# Altium project Prototyp2_Exjobb.PrjPcb
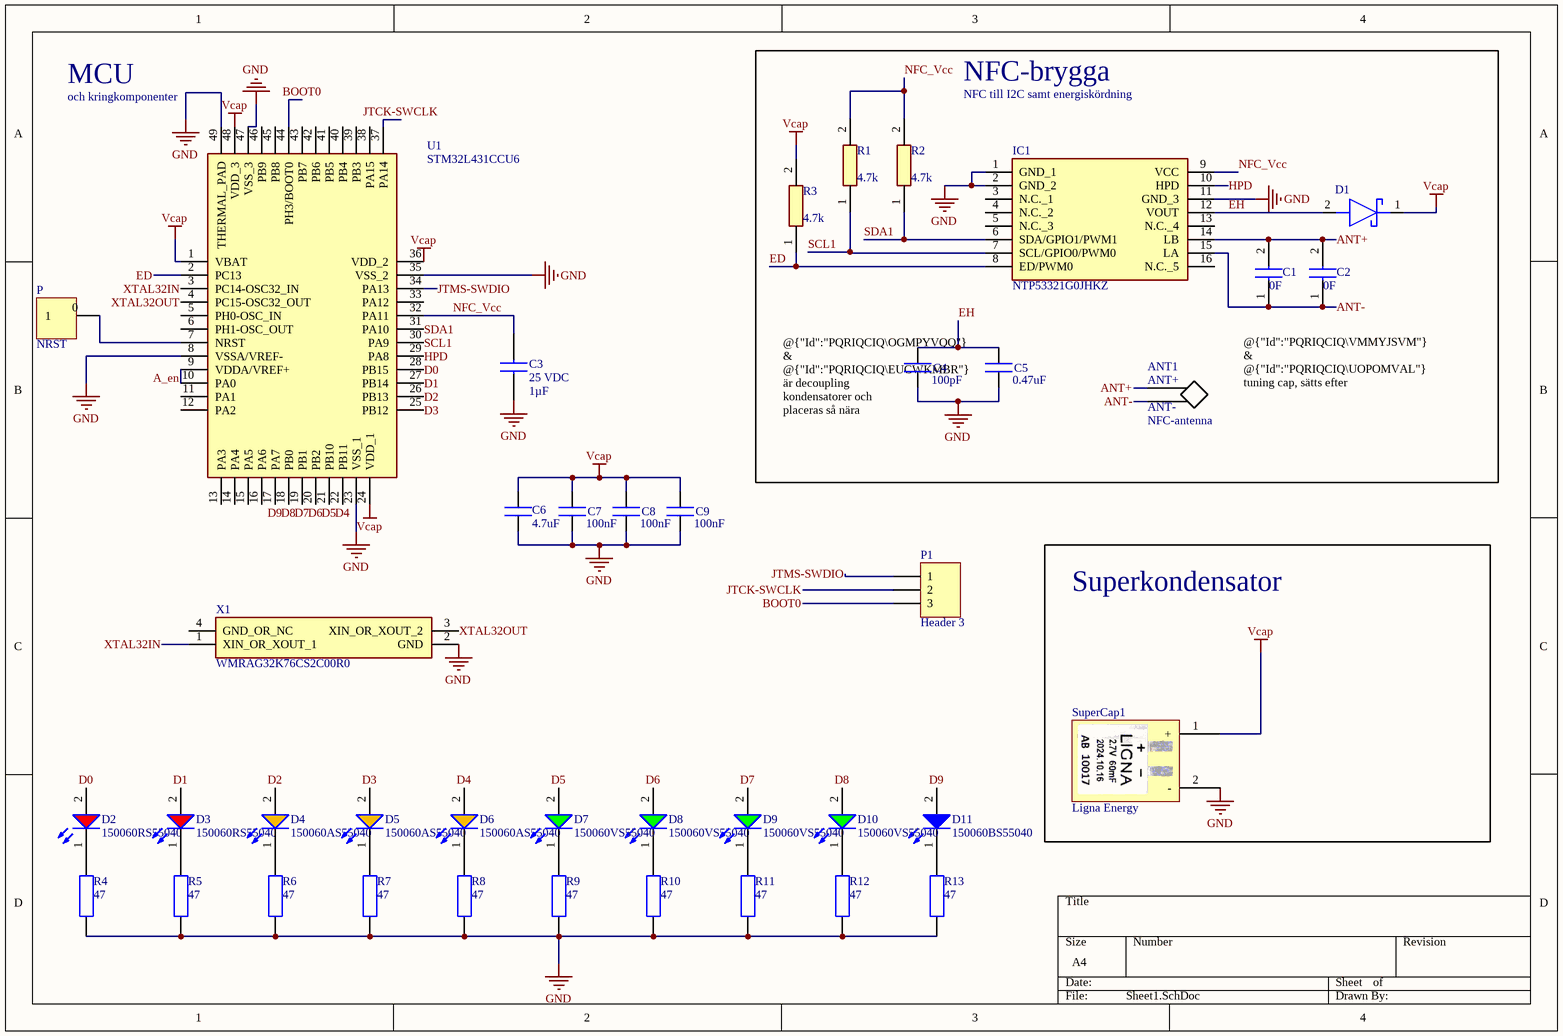
[diagram p0: Sheet1.SchDoc]
1 sheet, 40 parts. Net scope: global (net labels, ports and power ports of the same name join across sheets).
Board files: PCB1.PcbDoc, PCB2.PcbDoc, PCB3.PcbDoc

## Sheet Sheet1.SchDoc
size A4; SheetNumber: 1; SheetTotal: 1

### Parts
ANT1  NFC-antenna  [antenna3]
C1  value 0F  [CAPC1005X70N]  (hidden comment: GRM155C81C474KE01D)
C2  value 0F  [CAPC1005X70N]  (hidden comment: GRM155C81C474KE01D)
C3  value 1µF  Rated Voltage: 25 VDC  [CAPC1005X55N]  (hidden comment: GRM155R61E105KA12D)
C4  capacitance: 100pF  [CAPC1005X70N]  (hidden comment: C0402C101KCGACAUTO)
C5  capacitance: 0.47uF  [CAPC1005X70N]  (hidden comment: C0402C101KCMBASJ105SB7474KFNA01GACAUTO)
C6  capacitance: 4.7uF  [CAPC1005X70N]  (hidden comment: C0402C475K8PACTU)
C7  capacitance: 100nF  [CAPC1005X70N]  (hidden comment: MLAST105SB5104KFNA01)
C8  capacitance: 100nF  [CAPC1005X70N]  (hidden comment: MLAST105SB5104KFNA01)
C9  capacitance: 100nF  [CAPC1005X70N]  (hidden comment: MLAST105SB5104KFNA01)
D1  RBE01VYM6AFHTR  [RBE01VYM6AFHTR]  (value not drawn)
D2  150060RS55040  [WL-SMCD_0603]
D3  150060RS55040  [WL-SMCD_0603]
D4  150060AS55040  [WL-SMCD_0603]
D5  150060AS55040  [WL-SMCD_0603]
D6  150060AS55040  [WL-SMCD_0603]
D7  150060VS55040  [WL-SMCD_0603]
D8  150060VS55040  [WL-SMCD_0603]
D9  150060VS55040  [WL-SMCD_0603]
D10  150060VS55040  [WL-SMCD_0603]
D11  150060BS55040  [WL-SMCD_0603]
IC1  NTP53321G0JHKZ  [NTP53321G0JHKZ]
P  NRST  [Testupoint]
P1  Header 3  [HDR1X3]
R1  Resistance: 4.7k  [RESC1005X40N]  (hidden comment: CRCW04024K70FKEDHP)
R2  Resistance: 4.7k  [RESC1005X40N]  (hidden comment: CRCW04024K70FKEDHP)
R3  Resistance: 4.7k  [RESC1005X40N]  (hidden comment: CRCW04024K70FKEDHP)
R4  resistance: 47  [RESC1005X40N]  (hidden comment: SFR01MZPJ470)
R5  resistance: 47  [RESC1005X40N]  (hidden comment: SFR01MZPJ470)
R6  resistance: 47  [RESC1005X40N]  (hidden comment: SFR01MZPJ470)
R7  resistance: 47  [RESC1005X40N]  (hidden comment: SFR01MZPJ470)
R8  resistance: 47  [RESC1005X40N]  (hidden comment: SFR01MZPJ470)
R9  resistance: 47  [RESC1005X40N]  (hidden comment: SFR01MZPJ470)
R10  resistance: 47  [RESC1005X40N]  (hidden comment: SFR01MZPJ470)
R11  resistance: 47  [RESC1005X40N]  (hidden comment: SFR01MZPJ470)
R12  resistance: 47  [RESC1005X40N]  (hidden comment: SFR01MZPJ470)
R13  resistance: 47  [RESC1005X40N]  (hidden comment: SFR01MZPJ470)
SuperCap1  Ligna Energy  [S-Power 2R slim]
U1  STM32L431CCU6  [QFN50P700X700X60-49N-D]
X1  WMRAG32K76CS2C00R0  [WMRAG32K76CS2C00R0]

### Blocks framed on the sheet
NFC-brygga: ANT1 C1 C2 C4 C5 D1 IC1 R1-R3
Superkondensator: SuperCap1

### Nets
GND: C3.2 C4.1 C5.1 C6.2 C7.2 C8.2 C9.2 IC1.1(GND_1) IC1.2(GND_2) IC1.11(GND_3) R4.1 R5.1 R6.2 R7.2 R8.2 R9.2 R10.2 R11.2 R12.2 R13.2 SuperCap1.2(-) U1.8(VSSA/VREF-) U1.23(VSS_1) U1.35(VSS_2) U1.47(VSS_3) U1.49(THERMAL_PAD) X1.2(GND)
Vcap: C6.1 C7.1 C8.1 C9.1 D1.1(K) R3.2 SuperCap1.1(+) U1.1(VBAT) U1.24(VDD_1) U1.36(VDD_2) U1.48(VDD_3)
A_en: U1.9(VDDA/VREF+) U1.10(PA0)
ANT+: ANT1.1(+) C1.2 C2.2 IC1.14(LB)
ANT-: ANT1.1(-) C1.1 C2.1 IC1.15(LA)
BOOT0: P1.3 U1.44(PH3/BOOT0)
D0: D2.2(A) U1.28(PB15)
D1: D3.2(A) U1.27(PB14)
D2: D4.2(A) U1.26(PB13)
D3: D5.2(A) U1.25(PB12)
D4: D6.2(A) U1.22(PB11)
D5: D7.2(A) U1.21(PB10)
D6: D8.2(A) U1.20(PB2)
D7: D9.2(A) U1.19(PB1)
D8: D10.2(A) U1.18(PB0)
D9: D11.2(A) U1.17(PA7)
ED: IC1.8(ED/PWM0) R3.1 U1.2(PC13)
EH: C4.2 C5.2 D1.2(A) IC1.12(VOUT)
HPD: IC1.10(HPD) U1.29(PA8)
JTCK-SWCLK: P1.2 U1.37(PA14)
JTMS-SWDIO: P1.1 U1.34(PA13)
NFC_Vcc: C3.1 IC1.9(VCC) R1.2 R2.2 U1.32(PA11)
SCL1: IC1.7(SCL/GPIO0/PWM0) R1.1 U1.30(PA9)
SDA1: IC1.6(SDA/GPIO1/PWM1) R2.1 U1.31(PA10)
XTAL32IN: U1.3(PC14-OSC32_IN) X1.1(XIN_OR_XOUT_1)
XTAL32OUT: U1.4(PC15-OSC32_OUT) X1.3(XIN_OR_XOUT_2)
NetD2_1: D2.1(K) R4.2
NetD3_1: D3.1(K) R5.2
NetD4_1: D4.1(K) R6.1
NetD5_1: D5.1(K) R7.1
NetD6_1: D6.1(K) R8.1
NetD7_1: D7.1(K) R9.1
NetD8_1: D8.1(K) R10.1
NetD9_1: D9.1(K) R11.1
NetD10_1: D10.1(K) R12.1
NetD11_1: D11.1(K) R13.1
NetP_0: P.0(1) U1.7(NRST)

Not connected (* = marked no-connect by the designer): IC1 3(N.C._1) 4(N.C._2) 5(N.C._3) 13(N.C._4) 16(N.C._5); U1 5(PH0-OSC_IN) 6(PH1-OSC_OUT) 11(PA1) 12(PA2) 13(PA3) 14(PA4) 15(PA5) 16(PA6) 33(PA12) 38(PA15) 39(PB3) 40(PB4) 41(PB5) 42(PB6) 43(PB7) 45(PB8) 46(PB9); X1 4(GND_OR_NC)

### Notes on the sheet
- MCU
- (near U1) och kringkomponenter
- NFC till I2C samt energiskördning
- (near C4) @{"Id":"PQRIQCIQ\OGMPYVQQ"} & @{"Id":"PQRIQCIQ\EUCWKMBR"}
  är decoupling kondensatorer och placeras så nära NTPn som möjligt
- @{"Id":"PQRIQCIQ\VMMYJSVM"} & @{"Id":"PQRIQCIQ\UOPOMVAL"}
  tuning cap, sätts efter uppmätt induktans på antennen
- (in symbol NFC-antenna) ANT+; ANT-

### Library data of the parts
C1 C2 = CMP-001-00140-1: Multilayer Ceramic Capacitors MLCC - SMD/SMT; Manufacturer_Name: Murata Electronics; Design Item ID: GRM155C81C474KE01D; Mouser Part Number: 81-GRM155C81C474KE1D; Height: 0.7mm; Source: SamacSys.SchLib; Mouser Price/Stock: https://www.mouser.com/Search/Refine.aspx?Keyword=81-GRM155C81C474KE1D; Manufacturer_Part_Number: GRM155C81C474KE01D; Datasheet Link: https://search.murata.co.jp/Ceramy/image/img/A01X/G101/ENG/GRM155C81C474KE01-01A.pdf
C3 = CMP-001-00126-1: Capacitor; Manufacturer_Name: Murata Electronics; Datasheet Link: https://search.murata.co.jp/Ceramy/image/img/A01X/G101/ENG/GRM155R61E105KA12-01A.pdf; Source: SamacSys.SchLib; Mouser Part Number: 81-GRM155R61E105KA2D; Arrow Part Number: GRM155R61E105KA12D; Manufacturer_Part_Number: GRM155R61E105KA12D; Design Item ID: GRM155R61E105KA12D; Arrow Price/Stock: https://www.arrow.com/en/products/grm155r61e105ka12d/murata-manufacturing?region=nac; Height: 0.55mm; Mouser Price/Stock: https://www.mouser.co.uk/ProductDetail/Murata-Electronics/GRM155R61E105KA12D?qs=hiffU4J9V6bE4a81t2Mv5A%3D%3D
C4 C5 = Generic capacitor: Multilayer Ceramic Capacitors MLCC - SMD/SMT 500V 0.0001uF C0G 0402 10% AEC-Q200; ComponentLink1Description: New link
  C4: ComponentLink1URL: https://www.mouser.se/ProductDetail/KEMET/C0402C101KCGACAUTO?qs=1Kr7Jg1SGW8kQysZZQPmCw%3D%3D
  C5: ComponentLink1URL: https://www.mouser.se/ProductDetail/TAIYO-YUDEN/MBASJ105SB7474KFNA01?qs=tlsG%2FOw5FFh70%252Bw5vm%252Bxgg%3D%3D
C6 = Generic capacitor: Multilayer Ceramic Capacitors MLCC - SMD/SMT; ComponentLink1Description: New link; ComponentLink1URL: https://www.mouser.se/ProductDetail/TAIYO-YUDEN/MLASJ105BB5475MFNA01?qs=sGAEpiMZZMsh%252B1woXyUXj3XUfju0vRpjpyIV14TsoXE%3D
C7-C9 = Generic capacitor: Multilayer Ceramic Capacitors MLCC - SMD/SMT 25V 0.1uF X5R 0402 10% Medical; ComponentLink1Description: New link; ComponentLink1URL: https://www.mouser.se/ProductDetail/TAIYO-YUDEN/MLAST105SB5104KFNA01?qs=sGAEpiMZZMsh%252B1woXyUXj3XUfju0vRpjIEu19pL458I%3D
D1 = CMP-004-00062-1: DIODE SCHOTTKY 6V 100MA TUMD2M; Manufacturer_Name: ROHM Semiconductor; Mouser Part Number: 755-RBE01VYM6AFHTR; Datasheet Link: https://www.digikey.ph/en/products/detail/rohm-semiconductor/RBE01VYM6AFHTR/24634517; Manufacturer_Part_Number: RBE01VYM6AFHTR; Source: SamacSys.SchLib; Design Item ID: RBE01VYM6AFHTR; Mouser Price/Stock: https://www.mouser.co.uk/ProductDetail/ROHM-Semiconductor/RBE01VYM6AFHTR?qs=VVKQmw408U8czvswzPLZtQ%3D%3D; Height: 0.8mm
D2 D3 = CMP-207942-000007-3: LED RED DIFFUSED 0603 SMD; NexarPartId: 90235565; Reverse Voltage: 5V; Power Dissipation: 48mW; Luminous Intensity: 90mcd; Forward Voltage: 2V; Wavelength: 624nm; Max Junction Temperature (Tj): 115°C; Peak Wavelength: 632nm; Forward Current: 40mA; Viewing Angle: 140°; Case/Package: 0603; Height: 400µm; Packaging: Tape and Reel; Max Operating Temperature: 85°C; Min Operating Temperature: -40°C; Color: Red; Width: 800µm; Dominant Wavelength: 624nm; Length: 1.6mm; Max Reverse Voltage (DC): 5V; RoHS: Compliant
D4-D6 = CMP-03913-134708025-1: 150060AS55040 WL-SMCD SMT Mono-color Chip LED Diffused; Peak Wavelength: 609nm; Forward Current: 40mA; Luminous Intensity: 110mcd; Max Reverse Voltage (DC): 5V; Dominant Wavelength: 605nm; Forward Voltage: 2V; Viewing Angle: 140°; Min Operating Temperature: -40°C; NexarPartId: 134708025; Max Operating Temperature: 85°C
D7-D10 = CMP-03913-90235568-2: 150060VS55040 WL-SMCD SMT Mono-color Chip LED Diffused; Wavelength: 573nm; Forward Voltage: 2V; Luminous Intensity: 60mcd; Color: Green; Viewing Angle: 140°; Max Reverse Voltage (DC): 5V; Max Junction Temperature (Tj): 115°C; Peak Wavelength: 575nm; Power Dissipation: 48mW; Forward Current: 40mA; Height: 400µm; Max Operating Temperature: 85°C; Width: 800µm; NexarPartId: 90235568; Case/Package: 0603; Packaging: Tape and Reel; Dominant Wavelength: 573nm; Min Operating Temperature: -40°C; Reverse Voltage: 5V; Length: 1.6mm; RoHS: Compliant
D11 = CMP-03913-90235561-2: 150060BS55040 WL-SMCD SMT Mono-color Chip LED Diffused; Dominant Wavelength: 470nm; Forward Current: 60mA; Viewing Angle: 140°; Peak Wavelength: 465nm; Max Reverse Voltage (DC): 5V; Forward Voltage: 3.2V; Luminous Intensity: 80mcd; Max Operating Temperature: 85°C; Wavelength: 470nm; Min Operating Temperature: -40°C; Length: 1.6mm; Width: 800µm; Packaging: Tape and Reel; RoHS: Compliant; Height: 400µm; NexarPartId: 90235561
IC1 = CMP-031-00011-1: Interface - Specialized NTAG; Manufacturer_Name: NXP; Source: SamacSys.SchLib; Mouser Price/Stock: https://www.mouser.co.uk/ProductDetail/NXP-Semiconductors/NTP53321G0JHKZ?qs=u16ybLDytRYy2Rt%2Fib73Dw%3D%3D; Height: 0.5mm; Design Item ID: NTP53321G0JHKZ; Datasheet Link: https://www.nxp.com/docs/en/data-sheet/NTP53x2.pdf; Arrow Price/Stock: https://www.arrow.com/en/products/ntp53321g0jhkz/nxp-semiconductors?region=nac; Mouser Part Number: 771-NTP53321G0JHKZ; Manufacturer_Part_Number: NTP53321G0JHKZ; Arrow Part Number: NTP53321G0JHKZ
P = testpointu desu
P1 = CMP-002-00163-1: Header, 3-Pin; Signal Integrity: Connector; Source: Miscellaneous Connectors.SchLib; LatestRevisionNote: Re-released for DXP Platform.; Design Item ID: Header 3; Pins: 3; LatestRevisionDate: 17-Jul-2002; Component Type: Standard; Publisher: Altium Limited
R1-R3 = CMP-009-00230-1: CRCW Power Resistor 0402 0.063W 4K7 Vishay CRCW Series Thick Film Power Resistor 0402 Case 4.7k +/-1% 0.125W +/-100ppm/K; Source: SamacSys.SchLib; Height: 0.4mm; Manufacturer_Name: Vishay; Datasheet Link: http://www.vishay.com/docs/20035/dcrcwe3.pdf; Manufacturer_Part_Number: CRCW04024K70FKEDHP; Arrow Part Number: CRCW04024K70FKEDHP; Design Item ID: CRCW04024K70FKEDHP; Mouser Price/Stock: https://www.mouser.co.uk/ProductDetail/Vishay-Dale/CRCW04024K70FKEDHP?qs=k2%2FDWSARqgH3ASlI4vM3KQ%3D%3D; Mouser Part Number: 71-CRCW04024K70FKEDH; Arrow Price/Stock: https://www.arrow.com/en/products/crcw04024k70fkedhp/vishay?utm_currency=USD&region=nac
R4-R13 = Generic resistor: Thick Film Resistors Sulfur Tolerant Chip Resistors 0402 case size; ComponentLink1Description: New link; ComponentLink1URL: https://www.mouser.se/ProductDetail/ROHM-Semiconductor/SFR01MZPJ470?qs=sGAEpiMZZMvdGkrng054t2cqbZCzJY7NKh3gUwXOa5kuN5TNJ%252Bi2TA%3D%3D
SuperCap1 = S-Power 2R
U1 = CMP-031-00018-1: ARM Microcontrollers - MCU 16/32-BITS MICROS; Manufacturer_Name: STMicroelectronics; Mouser Part Number: 511-STM32L431CCU6; Height: 0.6mm; Arrow Part Number: STM32L431CCU6; Source: SamacSys.SchLib; Datasheet Link: http://www.st.com/content/ccc/resource/technical/document/datasheet/group3/83/b3/60/f6/b1/cc/47/7e/DM00257211/files/DM00257211.pdf/jcr:content/translations/en.DM00257211.pdf; Arrow Price/Stock: https://www.arrow.com/en/products/stm32l431ccu6/stmicroelectronics?region=nac; Mouser Price/Stock: https://www.mouser.co.uk/ProductDetail/STMicroelectronics/STM32L431CCU6?qs=U58vgkJzipRWiXTJcDrRbg%3D%3D; Manufacturer_Part_Number: STM32L431CCU6; Design Item ID: STM32L431CCU6
X1 = CMP-003-00031-1: 32.768 kHz +/-20ppm Crystal 8pF 75 kOhms 4-SMD; Manufacturer_Name: Murata Electronics; Manufacturer_Part_Number: WMRAG32K76CS2C00R0; Mouser Part Number: 81-WMRAG32K76CS2C00R; Source: SamacSys.SchLib; Height: 0.35mm; Datasheet Link: https://www.murata.com/products/productdata/8804604674078/SPEC-WMRAG32K76CS2C00R0.pdf; Design Item ID: WMRAG32K76CS2C00R0; Mouser Price/Stock: https://www.mouser.co.uk/ProductDetail/Murata-Electronics/WMRAG32K76CS2C00R0?qs=bZr6mbWTK5kWV2uyypDEfg%3D%3D